# Altium schematic sheet Nestling_2.1_EXB.SchDoc
size A4
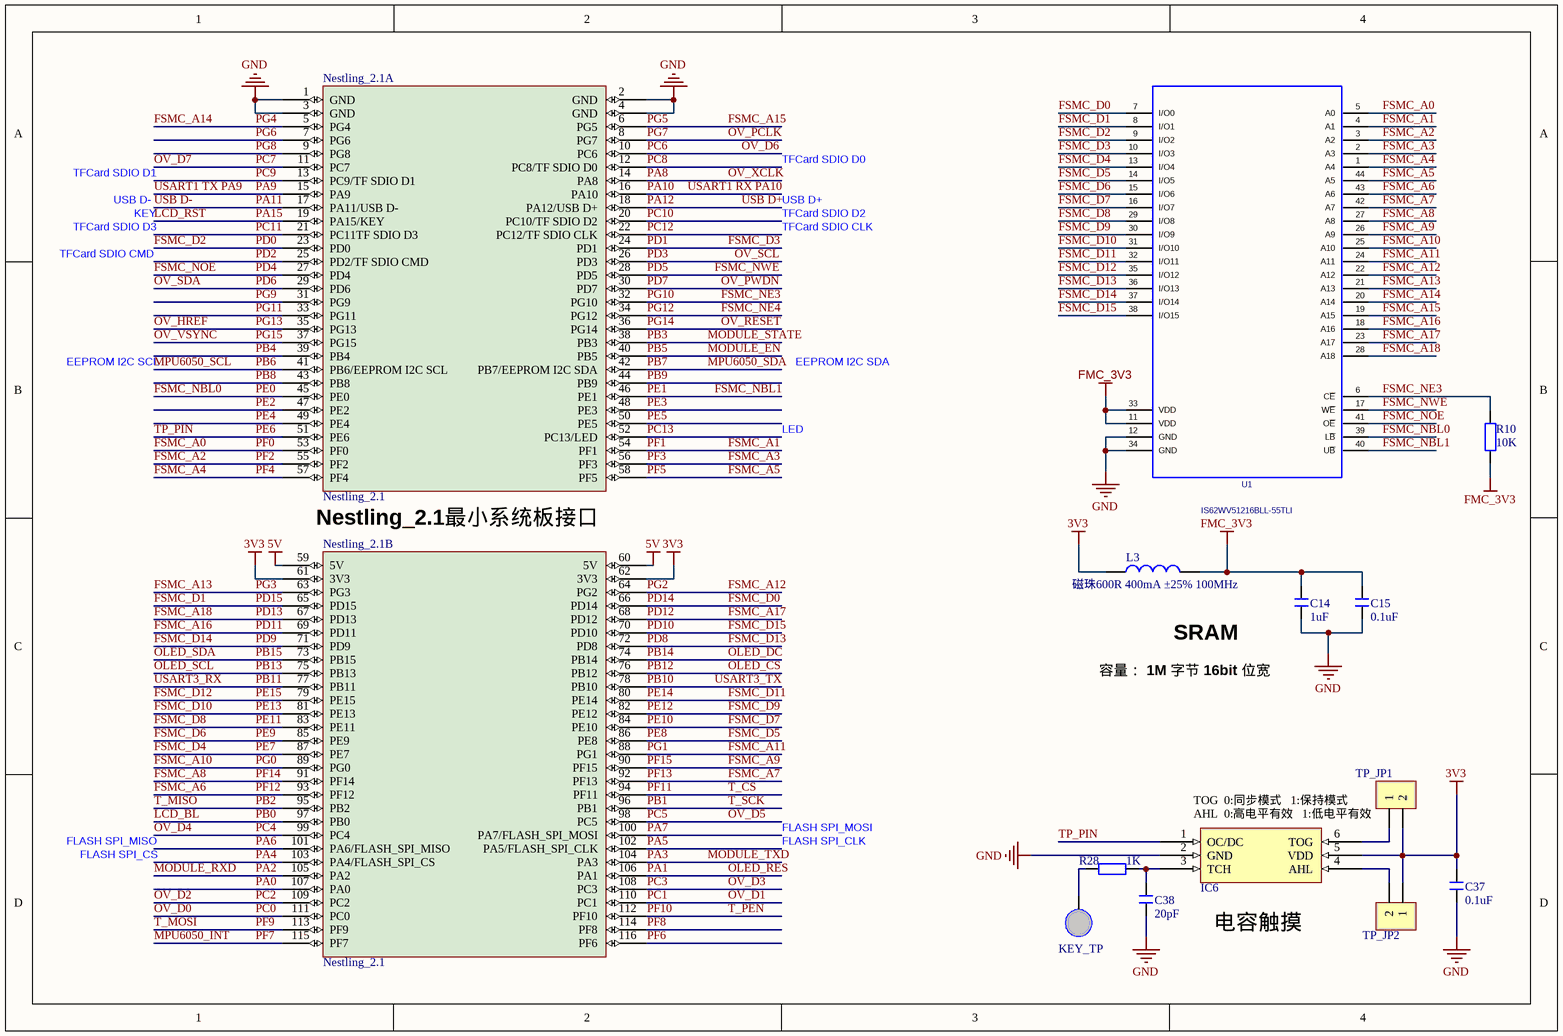
[diagram p0: Nestling_2.1_EXB.SchDoc]

## Parts
C14  1uF  [C 0603_M]
C15  0.1uF  [C 0603_M]
C37  0.1uF  [C 0603_M]
C38  20pF  [C 0603_M]
IC6  RH6015C SOT23-6  [SOT23-6N]  (value not drawn)
KEY_TP  TP_Pin  [TP_PIN_10*13mm]  (value not drawn)
L3  磁珠600R 400mA ±25% 100MHz  [L 0603]
Nestling_2.1  Nestling_2.1  [Nestling_2.1]  (parts A,B of 2)
R10  10K  [R 0603_M]
R28  1K  [R 0603_M]
TP_JP1  HDR-1X2  [HDR2.54-LI-2P]  (value not drawn)
TP_JP2  HDR-1X2  [HDR2.54-LI-2P]  (value not drawn)
U1  IS62WV51216BLL-55TLI  [TSOP44-0.8MM]

## Nets
3V3: C37.2 IC6.5(VDD) L3.1 Nestling_2.1.61(3V3) Nestling_2.1.62(3V3) TP_JP1.2 TP_JP2.1
5V: Nestling_2.1.59(5V) Nestling_2.1.60(5V)
FMC_3V3: C14.2 C15.2 L3.2 R10.2 U1.11(VDD) U1.33(VDD)
GND: C14.1 C15.1 C37.1 C38.1 IC6.2(GND) Nestling_2.1.1(GND) Nestling_2.1.2(GND) Nestling_2.1.3(GND) Nestling_2.1.4(GND) U1.12(GND) U1.34(GND)
FSMC_A0: Nestling_2.1.53(PF0) U1.5(A0)  [also labelled PF0]
FSMC_A1: Nestling_2.1.54(PF1) U1.4(A1)  [also labelled PF1]
FSMC_A2: Nestling_2.1.55(PF2) U1.3(A2)  [also labelled PF2]
FSMC_A3: Nestling_2.1.56(PF3) U1.2(A3)  [also labelled PF3]
FSMC_A4: Nestling_2.1.57(PF4) U1.1(A4)  [also labelled PF4]
FSMC_A5: Nestling_2.1.58(PF5) U1.44(A5)  [also labelled PF5]
FSMC_A6: Nestling_2.1.93(PF12) U1.43(A6)  [also labelled PF12]
FSMC_A7: Nestling_2.1.92(PF13) U1.42(A7)  [also labelled PF13]
FSMC_A8: Nestling_2.1.91(PF14) U1.27(A8)  [also labelled PF14]
FSMC_A9: Nestling_2.1.90(PF15) U1.26(A9)  [also labelled PF15]
FSMC_A10: Nestling_2.1.89(PG0) U1.25(A10)  [also labelled PG0]
FSMC_A11: Nestling_2.1.88(PG1) U1.24(A11)  [also labelled PG1]
FSMC_A12: Nestling_2.1.64(PG2) U1.22(A12)  [also labelled PG2]
FSMC_A13: Nestling_2.1.63(PG3) U1.21(A13)  [also labelled PG3]
FSMC_A14: Nestling_2.1.5(PG4) U1.20(A14)  [also labelled PG4]
FSMC_A15: Nestling_2.1.6(PG5) U1.19(A15)  [also labelled PG5]
FSMC_A16: Nestling_2.1.69(PD11) U1.18(A16)  [also labelled PD11]
FSMC_A17: Nestling_2.1.68(PD12) U1.23(A17)  [also labelled PD12]
FSMC_A18: Nestling_2.1.67(PD13) U1.28(A18)  [also labelled PD13]
FSMC_D0: Nestling_2.1.66(PD14) U1.7(I/O0)  [also labelled PD14]
FSMC_D1: Nestling_2.1.65(PD15) U1.8(I/O1)  [also labelled PD15]
FSMC_D2: Nestling_2.1.23(PD0) U1.9(I/O2)  [also labelled PD0]
FSMC_D3: Nestling_2.1.24(PD1) U1.10(I/O3)  [also labelled PD1]
FSMC_D4: Nestling_2.1.87(PE7) U1.13(I/O4)  [also labelled PE7]
FSMC_D5: Nestling_2.1.86(PE8) U1.14(I/O5)  [also labelled PE8]
FSMC_D6: Nestling_2.1.85(PE9) U1.15(I/O6)  [also labelled PE9]
FSMC_D7: Nestling_2.1.84(PE10) U1.16(I/O7)  [also labelled PE10]
FSMC_D8: Nestling_2.1.83(PE11) U1.29(I/O8)  [also labelled PE11]
FSMC_D9: Nestling_2.1.82(PE12) U1.30(I/O9)  [also labelled PE12]
FSMC_D10: Nestling_2.1.81(PE13) U1.31(I/O10)  [also labelled PE13]
FSMC_D11: Nestling_2.1.80(PE14) U1.32(I/O11)  [also labelled PE14]
FSMC_D12: Nestling_2.1.79(PE15) U1.35(I/O12)  [also labelled PE15]
FSMC_D13: Nestling_2.1.72(PD8) U1.36(I/O13)  [also labelled PD8]
FSMC_D14: Nestling_2.1.71(PD9) U1.37(I/O14)  [also labelled PD9]
FSMC_D15: Nestling_2.1.70(PD10) U1.38(I/O15)  [also labelled PD10]
FSMC_NBL0: Nestling_2.1.45(PE0) U1.39(L~{B})  [also labelled PE0]
FSMC_NBL1: Nestling_2.1.46(PE1) U1.40(U~{B})  [also labelled PE1]
FSMC_NE3: Nestling_2.1.32(PG10) R10.1 U1.6(C~{E})  [also labelled PG10]
FSMC_NE4: Nestling_2.1.34(PG12)  [also labelled PG12]
FSMC_NOE: Nestling_2.1.27(PD4) U1.41(O~{E})  [also labelled PD4]
FSMC_NWE: Nestling_2.1.28(PD5) U1.17(W~{E})  [also labelled PD5]
LCD_BL: Nestling_2.1.97(PB0)  [also labelled PB0]
LCD_RST: Nestling_2.1.19(PA15/KEY)  [also labelled PA15]
MODULE_EN: Nestling_2.1.40(PB5)  [also labelled PB5]
MODULE_RXD: Nestling_2.1.105(PA2)  [also labelled PA2]
MODULE_STATE: Nestling_2.1.38(PB3)  [also labelled PB3]
MODULE_TXD: Nestling_2.1.104(PA3)  [also labelled PA3]
MPU6050_INT: Nestling_2.1.115(PF7)  [also labelled PF7]
MPU6050_SCL: Nestling_2.1.41(PB6/EEPROM_I2C_SCL)  [also labelled PB6]
MPU6050_SDA: Nestling_2.1.42(PB7/EEPROM_I2C_SDA)  [also labelled PB7]
OLED_CS: Nestling_2.1.76(PB12)  [also labelled PB12]
OLED_DC: Nestling_2.1.74(PB14)  [also labelled PB14]
OLED_RES: Nestling_2.1.106(PA1)  [also labelled PA1]
OLED_SCL: Nestling_2.1.75(PB13)  [also labelled PB13]
OLED_SDA: Nestling_2.1.73(PB15)  [also labelled PB15]
OV_D0: Nestling_2.1.111(PC0)  [also labelled PC0]
OV_D1: Nestling_2.1.110(PC1)  [also labelled PC1]
OV_D2: Nestling_2.1.109(PC2)  [also labelled PC2]
OV_D3: Nestling_2.1.108(PC3)  [also labelled PC3]
OV_D4: Nestling_2.1.99(PC4)  [also labelled PC4]
OV_D5: Nestling_2.1.98(PC5)  [also labelled PC5]
OV_D6: Nestling_2.1.10(PC6)  [also labelled PC6]
OV_D7: Nestling_2.1.11(PC7)  [also labelled PC7]
OV_HREF: Nestling_2.1.35(PG13)  [also labelled PG13]
OV_PCLK: Nestling_2.1.8(PG7)  [also labelled PG7]
OV_PWDN: Nestling_2.1.30(PD7)  [also labelled PD7]
OV_RESET: Nestling_2.1.36(PG14)  [also labelled PG14]
OV_SCL: Nestling_2.1.26(PD3)  [also labelled PD3]
OV_SDA: Nestling_2.1.29(PD6)  [also labelled PD6]
OV_VSYNC: Nestling_2.1.37(PG15)  [also labelled PG15]
OV_XCLK: Nestling_2.1.14(PA8)  [also labelled PA8]
PA0: Nestling_2.1.107(PA0)
PA4: Nestling_2.1.103(PA4/FLASH_SPI_CS)
PA5: Nestling_2.1.102(PA5/FLASH_SPI_CLK)
PA6: Nestling_2.1.101(PA6/FLASH_SPI_MISO)
PA7: Nestling_2.1.100(PA7/FLASH_SPI_MOSI)
PA9: Nestling_2.1.15(PA9)  [also labelled USART1 TX PA9]
PA10: Nestling_2.1.16(PA10)  [also labelled USART1 RX PA10]
PA11: Nestling_2.1.17(PA11/USB_D-)  [also labelled USB D-]
PA12: Nestling_2.1.18(PA12/USB_D+)  [also labelled USB D+]
PB1: Nestling_2.1.96(PB1)  [also labelled T_SCK]
PB2: Nestling_2.1.95(PB2)  [also labelled T_MISO]
PB4: Nestling_2.1.39(PB4)
PB8: Nestling_2.1.43(PB8)
PB9: Nestling_2.1.44(PB9)
PB10: Nestling_2.1.78(PB10)  [also labelled USART3_TX]
PB11: Nestling_2.1.77(PB11)  [also labelled USART3_RX]
PC8: Nestling_2.1.12(PC8/TF_SDIO_D0)
PC9: Nestling_2.1.13(PC9/TF_SDIO_D1)
PC10: Nestling_2.1.20(PC10/TF_SDIO_D2)
PC11: Nestling_2.1.21(PC11TF_SDIO_D3)
PC12: Nestling_2.1.22(PC12/TF_SDIO_CLK)
PC13: Nestling_2.1.52(PC13/LED)
PD2: Nestling_2.1.25(PD2/TF_SDIO_CMD)
PE2: Nestling_2.1.47(PE2)
PE3: Nestling_2.1.48(PE3)
PE4: Nestling_2.1.49(PE4)
PE5: Nestling_2.1.50(PE5)
PE6: IC6.1(OC/DC) Nestling_2.1.51(PE6)  [also labelled TP_PIN]
PF6: Nestling_2.1.116(PF6)
PF8: Nestling_2.1.114(PF8)
PF9: Nestling_2.1.113(PF9)  [also labelled T_MOSI]
PF10: Nestling_2.1.112(PF10)  [also labelled T_PEN]
PF11: Nestling_2.1.94(PF11)  [also labelled T_CS]
PG6: Nestling_2.1.7(PG6)
PG8: Nestling_2.1.9(PG8)
PG9: Nestling_2.1.31(PG9)
PG11: Nestling_2.1.33(PG11)
NetC38_2: C38.2 IC6.3(TCH) R28.1
NetIC6_4: IC6.4(AHL) TP_JP2.2
NetIC6_6: IC6.6(TOG) TP_JP1.1
NetKEY_TP_1: KEY_TP.1 R28.2

## Notes on the sheet
- TFCard SDIO D1
- TFCard SDIO D0
- TFCard SDIO D3
- USB D-
- KEY
- TFCard SDIO CLK
- TFCard SDIO D2
- USB D+
- TFCard SDIO CMD
- EEPROM I2C SCL
- EEPROM I2C SDA
- LED
- (near Nestling_2.1) Nestling_2.1最小系统板接口
- (near L3) SRAM
- 容量： 1M 字节 16bit 位宽
- FLASH SPI_MISO
- FLASH SPI_CLK
- FLASH SPI_MOSI
- (near IC6) TOG  0:同步模式   1:保持模式
- (near IC6) AHL  0:高电平有效   1:低电平有效
- FLASH SPI_CS
- 电容触摸

## Library data of the parts
C14 C15 C37 C38 = C: 无极性贴片电容; 版权归属: 源创客; BOM名称: 无极性贴片电容; 学习资源: www.ooocke.com
IC6 = RH6015C: 贴片单通道电容式触摸感应控制开关IC
L3 = L: 小功率贴片电感; 版权归属: 源创客; BOM名称: 小功率贴片电感; 学习资源: www.ooocke.com
R10 R28 = RES: Resistor
TP_JP1 TP_JP2 = Header 2: 2P接插件; 版权归属: 源创客; BOM名称: 2P接插件; 学习资源: www.ooocke.com
U1 = IS62WV51216BLL-55TLI: TSOP-II,2.5V - 3.6V, 512K x 16,55ns; Manufacturer #1 PN: IS62WV51216BLL-55TI; Manufacturer #1: ISSI; Value: IS62WV51216BLL-55TI; Tolerance: 55ns; PCB DECAL: TSOP44-0.8MM